# Altium schematic sheet Lab1_PowerSupply.SchDoc: Lab 1 - Power Supply
size A; DrawnBy: Scott Zuidema; Engineer: Scott Zuidema; Organization: GVSU; Address1: Scott Zuidema; Address3: EGR 680; Address4: Dr. Karl Brakora; DocumentNumber: 0001; Revision: 1; SheetNumber: 1; SheetTotal: 1; ProjectName: Lab 1
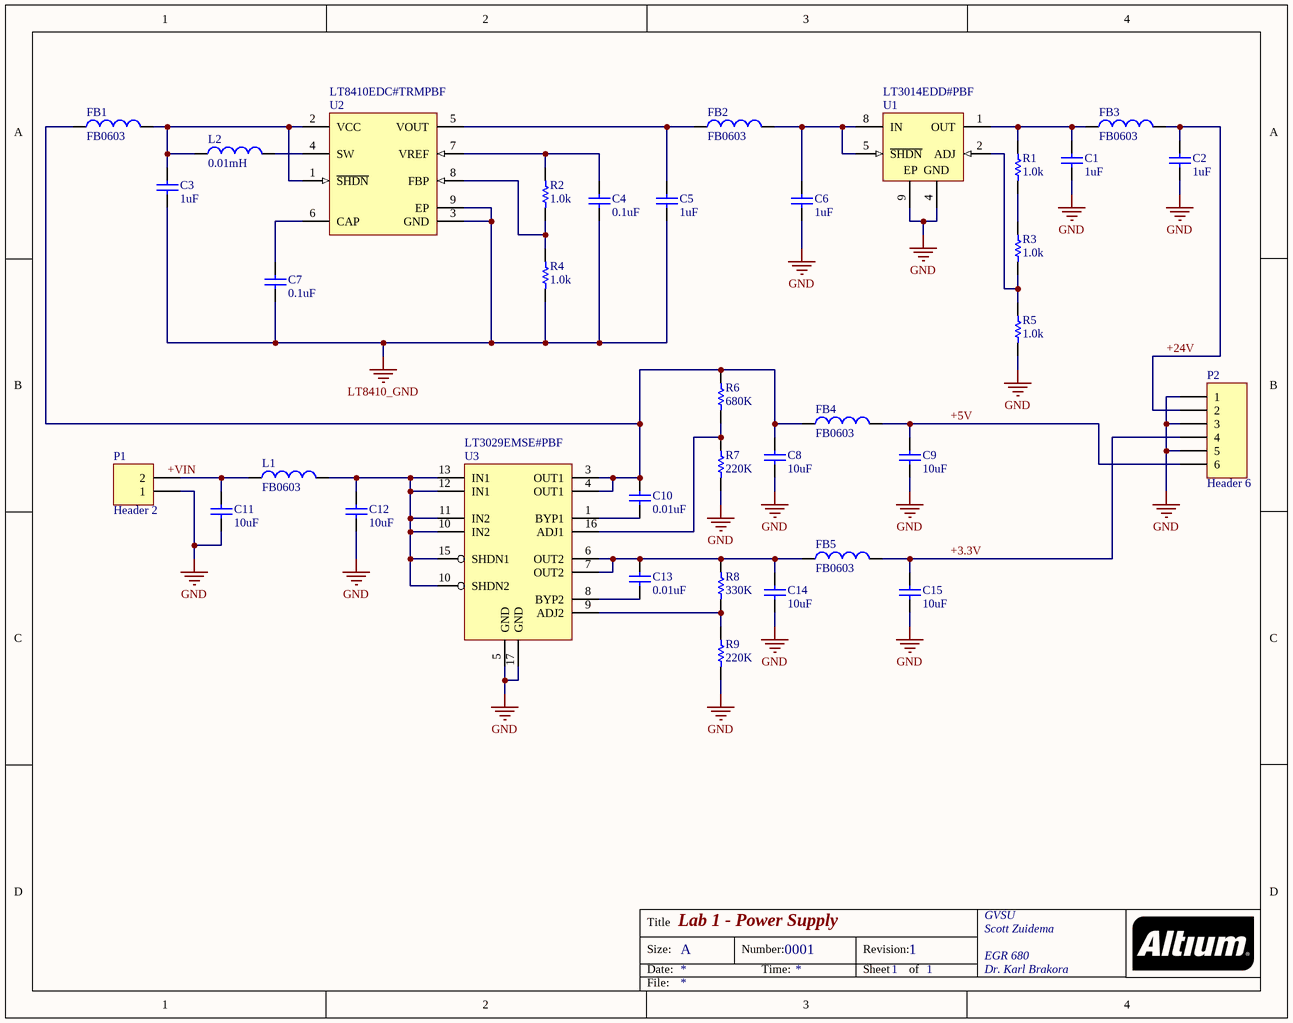
[diagram p0: Lab1_PowerSupply.SchDoc]

## Parts
C1  value 1uF  [0805CAP]  (hidden comment: C0805)
C2  value 1uF  [0805CAP]  (hidden comment: C0805)
C3  value 1uF  [0805CAP]  (hidden comment: C0805)
C4  value 0.1uF  [0603CAP]  (hidden comment: C0603)
C5  value 1uF  [0805CAP]  (hidden comment: C0805)
C6  value 1uF  [0805CAP]  (hidden comment: C0805)
C7  value 0.1uF  [0603CAP]  (hidden comment: C0603)
C8  value 10uF  [0805CAP]  (hidden comment: C0805)
C9  value 10uF  [0805CAP]  (hidden comment: C0805)
C10  value 0.01uF  [0603CAP]  (hidden comment: C0603)
C11  value 10uF  [0805CAP]  (hidden comment: C0805)
C12  value 10uF  [0805CAP]  (hidden comment: C0805)
C13  value 0.01uF  [0603CAP]  (hidden comment: C0603)
C14  value 10uF  [0805CAP]  (hidden comment: C0805)
C15  value 10uF  [0805CAP]  (hidden comment: C0805)
FB1  FB0603  [0603CAP]
FB2  FB0603  [0603CAP]
FB3  FB0603  [0603CAP]
FB4  FB0603  [0603CAP]
FB5  FB0603  [0603CAP]
L1  FB0603  [0603CAP]
L2  value 0.01mH  [1210RES]  (hidden comment: L1210)
P1  Header 2  [HDR1X2]
P2  Header 6  [HDR1X6]
R1  value 1.0k  [0402RES]  (hidden comment: R0402)
R2  value 1.0k  [0402RES]  (hidden comment: R0402)
R3  value 1.0k  [0402RES]  (hidden comment: R0402)
R4  value 1.0k  [0402RES]  (hidden comment: R0402)
R5  value 1.0k  [0402RES]  (hidden comment: R0402)
R6  value 680K  [0402RES]  (hidden comment: R0402)
R7  value 220K  [0402RES]  (hidden comment: R0402)
R8  value 330K  [0402RES]  (hidden comment: R0402)
R9  value 220K  [0402RES]  (hidden comment: R0402)
U1  LT3014EDD#PBF  [LT-DD-8_V]
U2  LT8410EDC#TRMPBF  [LT-DC8_V]
U3  Manufacturer P/N: LT3029EMSE#PBF  [MSE16]  (hidden comment: LDO)

## Nets
GND: C1.1 C2.1 C6.1 C8.1 C9.1 C11.1 C12.1 C14.1 C15.1 P1.1 P2.1 P2.3 P2.5 R5.1 R7.1 R9.1 U1.4(GND) U1.9(EP) U3.5(GND) U3.17(GND)
LT8410_GND: C3.1 C4.1 C5.1 C7.1 R4.1 U2.3(GND) U2.9(EP)
+3.3V: C15.2 FB5.2 P2.4
+5V: C9.2 FB4.2 P2.6
+24V: C2.2 FB3.2 P2.2
NetC1_2: C1.2 FB3.1 R1.2 U1.1(OUT)
NetC3_2: C3.2 FB1.2 L2.1 U2.1(~{SHDN}) U2.2(VCC)
NetC4_2: C4.2 R2.2 U2.7(VREF)
NetC5_2: C5.2 FB2.1 U2.5(VOUT)
NetC6_2: C6.2 FB2.2 U1.5(~{SHDN}) U1.8(IN)
NetC7_2: C7.2 U2.6(CAP)
NetC8_2: C8.2 C10.2 FB1.1 FB4.1 R6.2 U3.3(OUT1) U3.4(OUT1)
NetC10_1: C10.1 U3.1(BYP1)
NetC11_2: C11.2 L1.1 P1.2
NetC12_2: C12.2 L1.2 U3.10(IN2) U3.11(IN2) U3.12(IN1) U3.13(IN1) U3.15(SHDN1)
NetC13_1: C13.1 U3.8(BYP2)
NetC13_2: C13.2 C14.2 FB5.1 R8.2 U3.6(OUT2) U3.7(OUT2)
NetL2_2: L2.2 U2.4(SW)
NetR1_1: R1.1 R3.2
NetR2_1: R2.1 R4.2 U2.8(FBP)
NetR3_1: R3.1 R5.2 U1.2(ADJ)
NetR6_1: R6.1 R7.2 U3.16(ADJ1)
NetR8_1: R8.1 R9.2 U3.9(ADJ2)

## Notes on the sheet
- Labels drawn without touching a wire or pin: +VIN
- Title
- Size:
- Date:
- A
- Number:
- Time:
- Revision:
- Sheet
- of
- File:

## Library data of the parts
C1-C3 C5 C6 C8 C9 C11 C12 C14 C15 = C0805: 0805 Ceramic Chip Capacitor - Standard
C4 C7 C10 C13 = C0603: 0603 Ceramic Chip Capacitor - Standard
FB1-FB5 L1 = FB0603: 0603 Multilayer Ferrite Power Bead; Manufacturer: KOA Speer; Manufacturer P/N: CZP1JFTTD121P; Vendor: Mouser; Vendor P/N: 660-CZP1JFTTD121P; Resistance @ 100MHz: 120; Price: 0.15; ComponentLink1URL: *
L2 = L1210: 1210 Chip Inductor - Standard
P1 = Header 2: Header, 2-Pin; LatestRevisionDate: 17-Jul-2002; LatestRevisionNote: Re-released for DXP Platform.; Publisher: Altium Limited
P2 = Header 6: Header, 6-Pin; LatestRevisionDate: 17-Jul-2002; LatestRevisionNote: Re-released for DXP Platform.; Publisher: Altium Limited
R1-R9 = R0402: 0402 Chip Resistor - Standard; ComponentLink1URL: *
U1 = LT3014EDD#PBF: 20 mA, Low Dropout Micropower Linear Regulator, 3 to 80 V Vin, Adjustable Vout, 8-pin SON (DD-8), -40 to 125 degC, Pb-Free; Manufacturer: Linear Technology; Discrete Pass Element: no; Dropout Voltage(V): 0.35; Iout(mA): 20; Isupply(mA): 0.007; Noise(uV): 115; Number of Outputs: 1; Output Voltage: Adj; PSRR(dB): 70; Vin Max(V): 80; Vin Min(V): 3; Vout Max(V): 60; Vout Min(V): 1.22; DatasheetVersion: Rev. D; PackageVersion: Jun-10; PackageReference: DD-8; PackageDescription: 8-Pin Plastic DFN, Body 3 x 3 mm, Pitch 0.5 mm; Supplier 1: Digi-Key; Supplier Part Number 1: LT3014EDD#PBF-ND; Supplier 2: Farnell; Supplier Part Number 2: 1663546; Supplier 3: Newark; Supplier Part Number 3: 57M7903; RoHS: TRUE; Shutdown Current(uA): 1; Mounting Technology: Surface Mount; Code_JEDEC: MO-229; ComponentLink1Description: Manufacturer URL; ComponentLink1URL: W:\EGR680\AltiumCustomLibraries\LinearTechnologies\Datasheets\3014fd.pdf; ComponentLink2Description: Datasheet; ComponentLink2URL: http://cds.linear.com/docs/en/datasheet/3014fd.pdf; ComponentLink3Description: Package Specification; ComponentLink3URL: http://cds.linear.com/docs/en/packaging/DFN_8_05-08-1698.pdf
U2 = LT8410EDC#TRMPBF: Ultralow Power Boost Converter with Output Disconnect, 8-pin SON (DC8), -40 to 125 degC, Pb-Free, Mini Tape and Reel; Manufacturer: Linear Technology; Number of Outputs: 1; DatasheetVersion: Rev. B; PackageVersion: Rev. A, 04/2009; PackageReference: DC8; PackageDescription: 8-Pin Plastic DFN, Body 2 x 2 mm, Pitch 0.45 mm; Supplier 1: Digi-Key; Supplier Part Number 1: LT8410EDC#TRMPBFTR-ND; Supplier 2: Digi-Key; Supplier Part Number 2: LT8410EDC#TRMPBFCT-ND; Supplier 3: Digi-Key; Supplier Part Number 3: LT8410EDC#TRMPBFDKR-ND; Supplier 4: Newark; Supplier Part Number 4: 19P1078; Packing: Mini Tape and Reel; RoHS: TRUE; Mounting Technology: Surface Mount; ComponentLink1Description: Datasheet; ComponentLink1URL: W:\EGR680\AltiumCustomLibraries\LinearTechnologies\Datasheets\84101fc.pdf; ComponentLink3Description: Package Specification; ComponentLink3URL: http://cds.linear.com/docs/en/packaging/DFN_8_05-08-1719.pdf; Price: 2.60710
U3 = LT3029MSE: Dual 500mA/500mA, Low Dropout, Low Noise, Micropower Linear Regulator; Manufacturer: Linear Technologies; Vendor: Digikey; Vendor P/N: LT3029EMSE#PBF-ND; Price: 3.55980; ComponentLink1URL: W:\EGR680\AltiumCustomLibraries\LinearTechnologies\Datasheets\3029fb.pdf; ComponentLink1Description: Datasheet